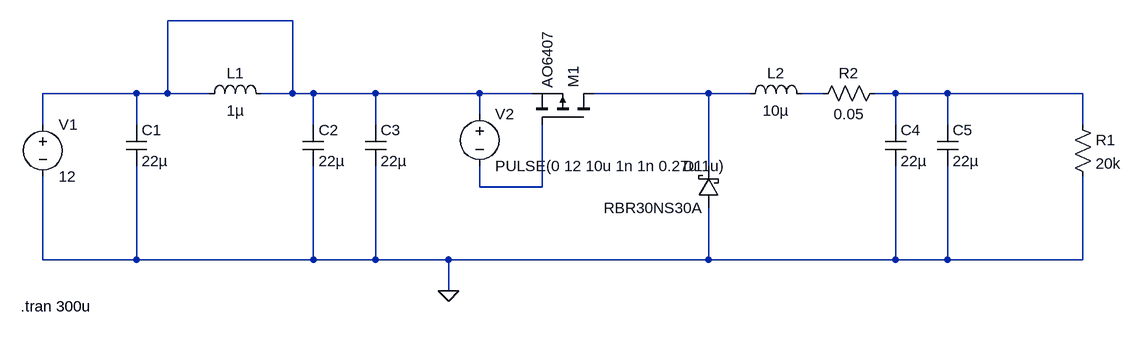
[diagram p0: schematic 5V2 Plant Rev02.asc]
5V2 Plant Rev02.asc, the LTspice schematic file:
Version 4
SHEET 1 1684 680
WIRE 400 0 208 0
WIRE 160 112 16 112
WIRE 208 112 208 0
WIRE 208 112 160 112
WIRE 272 112 208 112
WIRE 400 112 400 0
WIRE 400 112 352 112
WIRE 432 112 400 112
WIRE 528 112 432 112
WIRE 688 112 528 112
WIRE 768 112 688 112
WIRE 1040 112 864 112
WIRE 1104 112 1040 112
WIRE 1216 112 1184 112
WIRE 1328 112 1296 112
WIRE 1408 112 1328 112
WIRE 1616 112 1408 112
WIRE 688 144 688 112
WIRE 16 160 16 112
WIRE 160 160 160 112
WIRE 432 160 432 112
WIRE 528 160 528 112
WIRE 1328 160 1328 112
WIRE 1408 160 1408 112
WIRE 1616 160 1616 112
WIRE 1040 224 1040 112
WIRE 688 256 688 224
WIRE 784 256 784 160
WIRE 784 256 688 256
WIRE 16 368 16 240
WIRE 160 368 160 224
WIRE 160 368 16 368
WIRE 432 368 432 224
WIRE 432 368 160 368
WIRE 528 368 528 224
WIRE 528 368 432 368
WIRE 640 368 528 368
WIRE 1040 368 1040 288
WIRE 1040 368 640 368
WIRE 1328 368 1328 224
WIRE 1328 368 1040 368
WIRE 1408 368 1408 224
WIRE 1408 368 1328 368
WIRE 1616 368 1616 240
WIRE 1616 368 1408 368
WIRE 640 416 640 368
FLAG 640 416 0
SYMBOL voltage 16 144 R0
WINDOW 123 0 0 Left 0
WINDOW 39 0 0 Left 0
SYMATTR InstName V1
SYMATTR Value 12
SYMBOL cap 144 160 R0
SYMATTR InstName C1
SYMATTR Value 22µ
SYMATTR SpiceLine Rser=3m
SYMBOL ind 256 128 R270
WINDOW 0 32 56 VTop 2
WINDOW 3 5 56 VBottom 2
SYMATTR InstName L1
SYMATTR Value 1µ
SYMATTR SpiceLine Rser=49m
SYMBOL cap 416 160 R0
SYMATTR InstName C2
SYMATTR Value 22µ
SYMATTR SpiceLine Rser=3m
SYMBOL cap 512 160 R0
SYMATTR InstName C3
SYMATTR Value 22µ
SYMATTR SpiceLine Rser=3m
SYMBOL pmos 864 160 M270
SYMATTR InstName M1
SYMATTR Value AO6407
SYMBOL ind 1088 128 R270
WINDOW 0 32 56 VTop 2
WINDOW 3 5 56 VBottom 2
SYMATTR InstName L2
SYMATTR Value 10µ
SYMATTR SpiceLine Rser=60m
SYMBOL schottky 1056 288 R180
WINDOW 0 24 64 Left 2
WINDOW 3 24 0 Left 2
SYMATTR InstName D1
SYMATTR Value RBR30NS30A
SYMATTR Description Diode
SYMATTR Type diode
SYMBOL voltage 688 128 R0
WINDOW 123 0 0 Left 0
WINDOW 39 0 0 Left 0
SYMATTR InstName V2
SYMATTR Value PULSE(0 12 10u 1n 1n 0.27u 1u)
SYMBOL cap 1312 160 R0
SYMATTR InstName C4
SYMATTR Value 22µ
SYMATTR SpiceLine Rser=3m
SYMBOL cap 1392 160 R0
SYMATTR InstName C5
SYMATTR Value 22µ
SYMATTR SpiceLine Rser=3m
SYMBOL res 1600 144 R0
SYMATTR InstName R1
SYMATTR Value 20k
SYMBOL res 1312 96 R90
WINDOW 0 0 56 VBottom 2
WINDOW 3 32 56 VTop 2
SYMATTR InstName R2
SYMATTR Value 0.05
TEXT -18 440 Left 2 !.tran 300u

The netlist it stands for:
* 5V2 Plant Rev02.asc
V1 N001 0 12
C1 N001 0 22µ Rser=3m
L1 N001 N001 1µ Rser=49m
C2 N001 0 22µ Rser=3m
C3 N001 0 22µ Rser=3m
M1 N002 N005 N001 N001 AO6407
L2 N002 N003 10µ Rser=60m
D1 0 N002 RBR30NS30A
V2 N001 N005 PULSE(0 12 10u 1n 1n 0.27u 1u)
C4 N004 0 22µ Rser=3m
C5 N004 0 22µ Rser=3m
R1 N004 0 20k
R2 N004 N003 0.05
.model D D
.lib standard.dio
.model NMOS NMOS
.model PMOS PMOS
.lib standard.mos
.tran 300u
.backanno
.end